# Altium project pdb-24.PrjPcb (part 2 of 2)

## Sheet can-stm32g4.SchDoc
size Legal; SheetNumber: 9; SheetTotal: 9
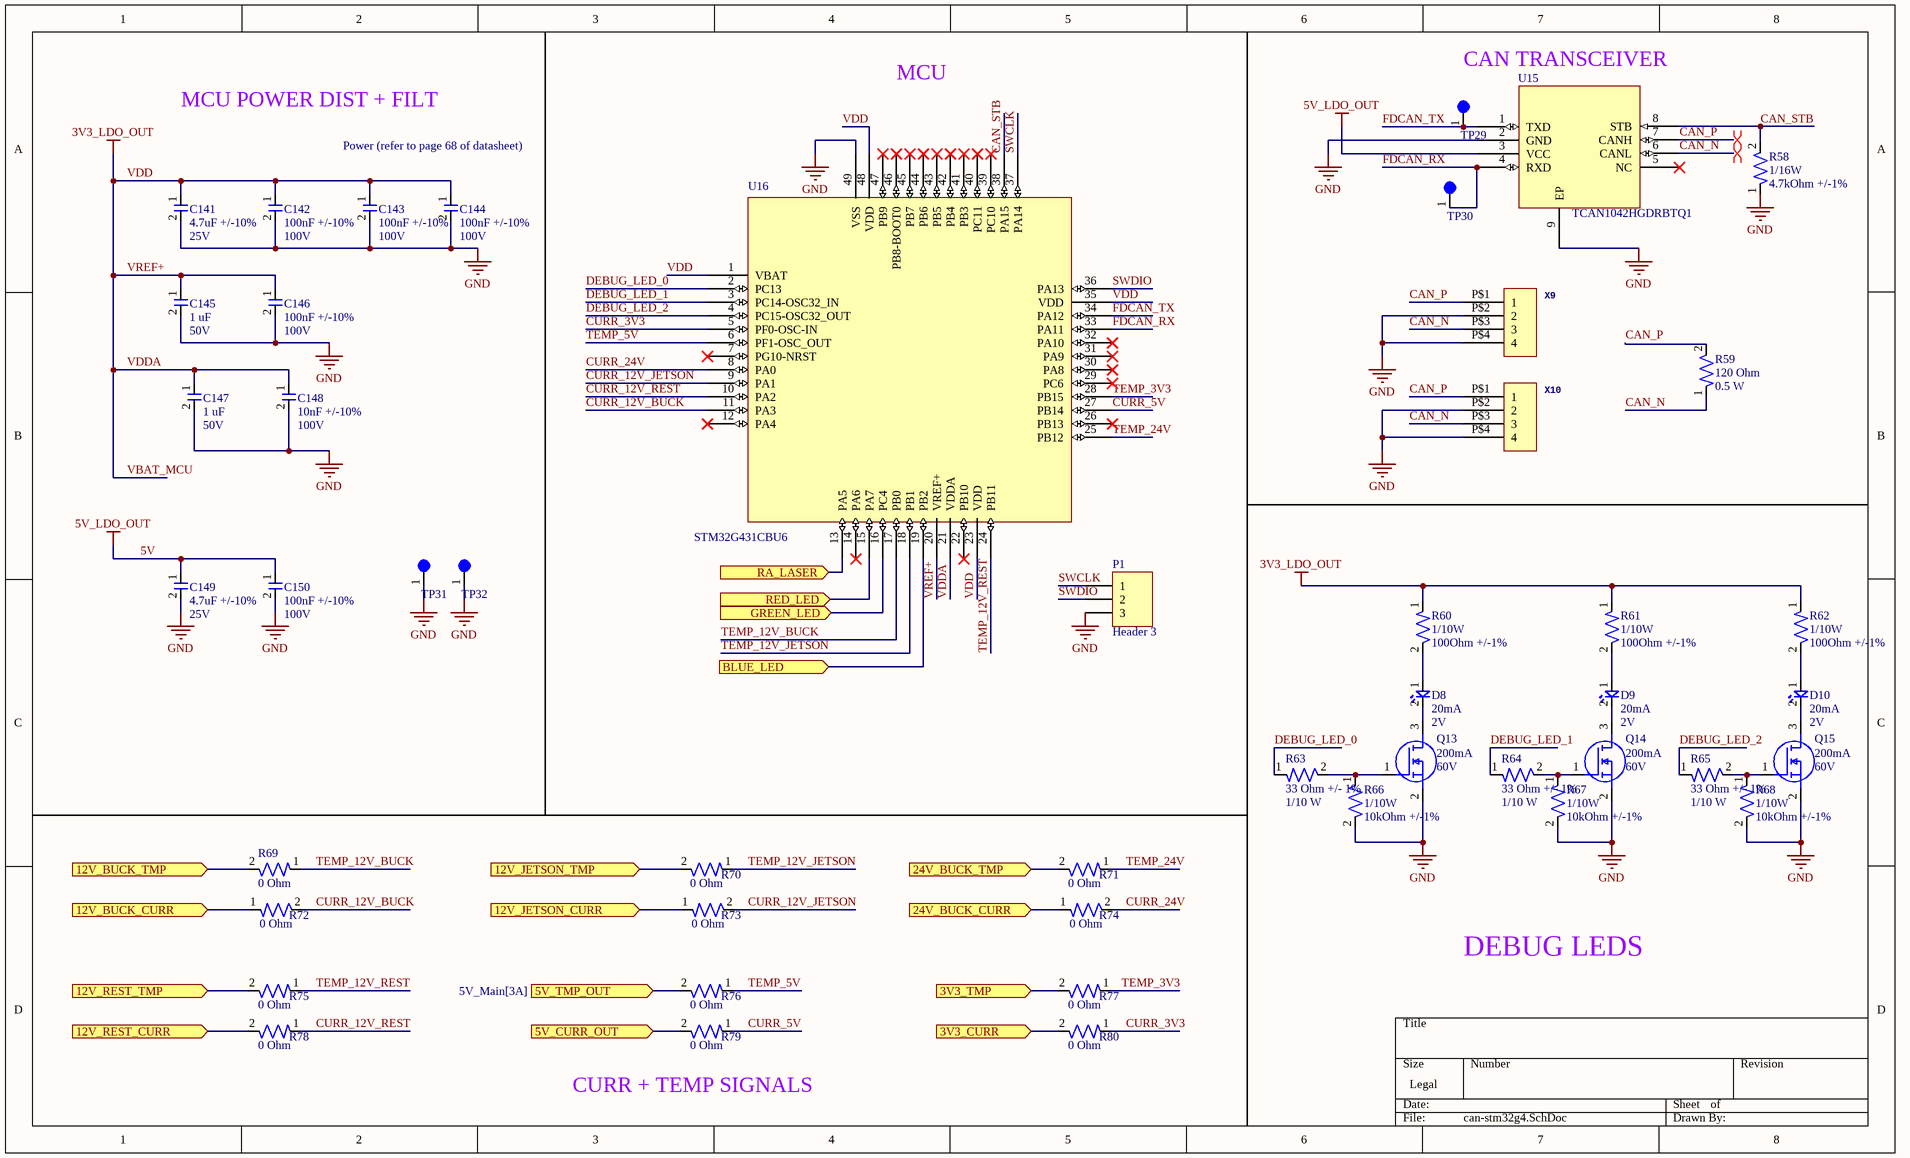
[diagram p7: can-stm32g4.SchDoc]

### Parts
C141  Capacitance: 4.7uF +/-10%  Voltage Rating: 25V  [CAP-0603]  (hidden comment: TMK107BBJ475KA-T)
C142  Capacitance: 100nF +/-10%  Voltage Rating: 100V  [CAP-0603]  (hidden comment: CC0603KRX7R0BB104)
C143  Capacitance: 100nF +/-10%  Voltage Rating: 100V  [CAP-0603]  (hidden comment: CC0603KRX7R0BB104)
C144  Capacitance: 100nF +/-10%  Voltage Rating: 100V  [CAP-0603]  (hidden comment: CC0603KRX7R0BB104)
C145  Capacitance: 1 uF  Voltage: 50V  [CAP-0603]  (hidden comment: UMK107AB7105KA-T)
C146  Capacitance: 100nF +/-10%  Voltage Rating: 100V  [CAP-0603]  (hidden comment: CC0603KRX7R0BB104)
C147  Capacitance: 1 uF  Voltage: 50V  [CAP-0603]  (hidden comment: UMK107AB7105KA-T)
C148  Capacitance: 10nF +/-10%  Voltage Rating: 100V  [CAP-0402]  (hidden comment: CC0402KRX7R0BB103)
C149  Capacitance: 4.7uF +/-10%  Voltage Rating: 25V  [CAP-0603]  (hidden comment: TMK107BBJ475KA-T)
C150  Capacitance: 100nF +/-10%  Voltage Rating: 100V  [CAP-0603]  (hidden comment: CC0603KRX7R0BB104)
D8  Current Rating: 20mA  Vf: 2V  [LED-0603]  (hidden comment: 150060AS75000)
D9  Current Rating: 20mA  Vf: 2V  [LED-0603]  (hidden comment: 150060AS75000)
D10  Current Rating: 20mA  Vf: 2V  [LED-0603]  (hidden comment: 150060AS75000)
P1  Header 3  [HDR1X3]
Q13  Id-Continuous: 200mA  VDS-Max: 60V  [NMOS-SOT23-3]  (hidden comment: T2N7002AK,LM)
Q14  Id-Continuous: 200mA  VDS-Max: 60V  [NMOS-SOT23-3]  (hidden comment: T2N7002AK,LM)
Q15  Id-Continuous: 200mA  VDS-Max: 60V  [NMOS-SOT23-3]  (hidden comment: T2N7002AK,LM)
R58  Power Rating: 1/16W  Resistance: 4.7kOhm +/-1%  [RES-0402]  (hidden comment: RC0402FR-074K7P)
R59  Resistance: 120 Ohm  Power: 0.5 W  [RES-1206]  (hidden comment: CRGH1206F120R)
R60  Power Rating: 1/10W  Resistance: 100Ohm +/-1%  [RES-0603]  (hidden comment: AC0603FR-10100RL)
R61  Power Rating: 1/10W  Resistance: 100Ohm +/-1%  [RES-0603]  (hidden comment: AC0603FR-10100RL)
R62  Power Rating: 1/10W  Resistance: 100Ohm +/-1%  [RES-0603]  (hidden comment: AC0603FR-10100RL)
R63  Resistance: 33 Ohm +/- 1%  Power: 1/10 W  [RES-0402]  (hidden comment: ERJ2RKF33R0X)
R64  Resistance: 33 Ohm +/- 1%  Power: 1/10 W  [RES-0402]  (hidden comment: ERJ2RKF33R0X)
R65  Resistance: 33 Ohm +/- 1%  Power: 1/10 W  [RES-0402]  (hidden comment: ERJ2RKF33R0X)
R66  Power Rating: 1/10W  Resistance: 10kOhm +/-1%  [RES-0603]  (hidden comment: RC0603FR-0710KP)
R67  Power Rating: 1/10W  Resistance: 10kOhm +/-1%  [RES-0603]  (hidden comment: RC0603FR-0710KP)
R68  Power Rating: 1/10W  Resistance: 10kOhm +/-1%  [RES-0603]  (hidden comment: RC0603FR-0710KP)
R69  Resistance: 0 Ohm  [RES-0603]  (hidden comment: RMCF0603ZT0R00)
R70  Resistance: 0 Ohm  [RES-0603]  (hidden comment: RMCF0603ZT0R00)
R71  Resistance: 0 Ohm  [RES-0603]  (hidden comment: RMCF0603ZT0R00)
R72  Resistance: 0 Ohm  [RES-0603]  (hidden comment: RMCF0603ZT0R00)
R73  Resistance: 0 Ohm  [RES-0603]  (hidden comment: RMCF0603ZT0R00)
R74  Resistance: 0 Ohm  [RES-0603]  (hidden comment: RMCF0603ZT0R00)
R75  Resistance: 0 Ohm  [RES-0603]  (hidden comment: RMCF0603ZT0R00)
R76  Resistance: 0 Ohm  [RES-0603]  (hidden comment: RMCF0603ZT0R00)
R77  Resistance: 0 Ohm  [RES-0603]  (hidden comment: RMCF0603ZT0R00)
R78  Resistance: 0 Ohm  [RES-0603]  (hidden comment: RMCF0603ZT0R00)
R79  Resistance: 0 Ohm  [RES-0603]  (hidden comment: RMCF0603ZT0R00)
R80  Resistance: 0 Ohm  [RES-0603]  (hidden comment: RMCF0603ZT0R00)
TP29  5003  [TEST-POINT-0001]  (value not drawn)
TP30  5003  [TEST-POINT-0001]  (value not drawn)
TP31  5003  [TEST-POINT-0001]  (value not drawn)
TP32  5003  [TEST-POINT-0001]  (value not drawn)
U15  TCAN1042HGDRBTQ1  [IC-8-VSON]
U16  STM32G431CBU6  [MCU-UFQFPN48]
X9  Molex 43045-0412  [43045-0412]  (value not drawn)
X10  Molex 43045-0412  [43045-0412]  (value not drawn)

### Ports
3V3_CURR (in), 3V3_TMP (in), 5V_CURR_OUT (in, see 5V_Main[2D]), 5V_TMP_OUT (in, see 5V_Main[3A]), 12V_BUCK_CURR (in, see 12V_For_Bucks[4D]), 12V_BUCK_TMP (in, see 12V_For_Bucks[3A]), 12V_JETSON_CURR (in, see 12V_Jetson[4D]), 12V_JETSON_TMP (in, see 12V_Jetson[3A]), 12V_REST_CURR (in, see 12V_Rest[4D]), 12V_REST_TMP (in, see 12V_Rest[3A]), 24V_BUCK_CURR (in, see 24V_Main[2D]), 24V_BUCK_TMP (in, see 24V_Main[4B]), BLUE_LED (in, see Connectors[1C]), GREEN_LED (in, see Connectors[1C]), RA_LASER (in, see Connectors[2C]), RED_LED (in, see Connectors[1D])

### Nets
5V: C149.1 C150.1 U15.3(VCC)  [also labelled 5V_LDO_OUT]
GND: C141.2 C142.2 C143.2 C144.2 C145.2 C146.2 C147.2 C148.2 C149.2 C150.2 P1.3 Q13.2(S) Q14.2(S) Q15.2(S) R58.1 R66.2 R67.2 R68.2 TP31.1 TP32.1 U15.2(GND) U15.9(EP) U16.49(VSS) X9.P$2(2) X9.P$4(4) X10.P$2(2) X10.P$4(4)
VBAT_MCU: C141.1 C142.1 C143.1 C144.1 C145.1 C146.1 C147.1 C148.1 R60.1 R61.1 R62.1 U16.1(VBAT) U16.20(VREF+) U16.21(VDDA) U16.23(VDD) U16.35(VDD) U16.48(VDD)  [also labelled 3V3_LDO_OUT, VDD, VDDA, VREF+]
CAN_N: R59.1 U15.6(CANL) X9.P$3(3) X10.P$3(3)
CAN_P: R59.2 U15.7(CANH) X9.P$1(1) X10.P$1(1)
CAN_STB: R58.2 U15.8(STB) U16.38(PA15)
CURR_3V3: R80.1 U16.5(PF0-OSC-IN)
CURR_5V: R79.1 U16.27(PB14)
CURR_12V_BUCK: R72.2 U16.11(PA3)
CURR_12V_JETSON: R73.2 U16.9(PA1)
CURR_12V_REST: R78.1 U16.10(PA2)
CURR_24V: R74.2 U16.8(PA0)
DEBUG_LED_0: R63.1 U16.2(PC13)
DEBUG_LED_1: R64.1 U16.3(PC14-OSC32_IN)
DEBUG_LED_2: R65.1 U16.4(PC15-OSC32_OUT)
FDCAN_RX: TP30.1 U15.4(RXD) U16.33(PA11)
FDCAN_TX: TP29.1 U15.1(TXD) U16.34(PA12)
SWCLK: P1.1 U16.37(PA14)
SWDIO: P1.2 U16.36(PA13)
TEMP_3V3: R77.1 U16.28(PB15)
TEMP_5V: R76.1 U16.6(PF1-OSC_OUT)
TEMP_12V_BUCK: R69.1 U16.17(PB0)
TEMP_12V_JETSON: R70.1 U16.18(PB1)
TEMP_12V_REST: R75.1 U16.24(PB11)
TEMP_24V: R71.1 U16.25(PB12)
NetD8_1: D8.1 R60.2
NetD8_2: D8.2 Q13.3(D)
NetD9_1: D9.1 R61.2
NetD9_2: D9.2 Q14.3(D)
NetD10_1: D10.1 R62.2
NetD10_2: D10.2 Q15.3(D)
NetQ2_1: U16.19(PB2) ; port BLUE_LED
NetQ3_1: U16.16(PC4) ; port GREEN_LED
NetQ4_1: U16.13(PA5) ; port RA_LASER
NetQ5_1: U16.15(PA7) ; port RED_LED
NetQ13_1: Q13.1(G) R63.2 R66.1
NetQ14_1: Q14.1(G) R64.2 R67.1
NetQ15_1: Q15.1(G) R65.2 R68.1
NetR3_2: R71.2 ; port 24V_BUCK_TMP
NetR12_2: R69.2 ; port 12V_BUCK_TMP
NetR19_2: R75.2 ; port 12V_REST_TMP
NetR28_2: R76.2 ; port 5V_TMP_OUT
NetR70_2: R70.2 ; port 12V_JETSON_TMP
NetR72_1: R72.1 ; port 12V_BUCK_CURR
NetR73_1: R73.1 ; port 12V_JETSON_CURR
NetR74_1: R74.1 ; port 24V_BUCK_CURR
NetR77_2: R77.2 ; port 3V3_TMP
NetR78_2: R78.2 ; port 12V_REST_CURR
NetR79_2: R79.2 ; port 5V_CURR_OUT
NetR80_2: R80.2 ; port 3V3_CURR

Not connected (* = marked no-connect by the designer): U15 5(NC)*; U16 7(PG10-NRST)* 12(PA4)* 14(PA6)* 22(PB10)* 26(PB13)* 29(PC6)* 30(PA8)* 31(PA9)* 32(PA10)* 39(PC10)* 40(PC11)* 41(PB3)* 42(PB4)* 43(PB5)* 44(PB6)* 45(PB7)* 46(PB8-BOOT0)* 47(PB9)*

### Layout directives
differential pair: CAN_N, CAN_P

### Notes on the sheet
- MCU
- CAN TRANSCEIVER
- MCU POWER DIST + FILT
- Power (refer to page 68 of datasheet)
- DEBUG LEDS
- (near R79) CURR + TEMP SIGNALS

### Library data of the parts
C141 C149 = CAP-4.7U-0001: 4.7 µF ±10% 25V Ceramic Capacitor X5R 0603 (1608 Metric); Manufacturer: Taiyo Yuden; Assembled?: no; Manufacturer Part Number: TMK107BBJ475KA-T; Temperature Coefficient: X5R; Package Size: 0603
C142-C144 C146 C150 = CAP-100N-0001: CAP CER 0.1UF 100V X7R 0603; Manufacturer: YAGEO; Assembled?: no; Manufacturer Part Number: CC0603KRX7R0BB104; Temperature Coefficient: X7R; Package Size: 0603
C145 C147 = CAP-1U-0002: 1 µF ±10% 50V Ceramic Capacitor X7R 0603 (1608 Metric); Package Size: 0603
C148 = CAP-10N-0001: 10000 pF ±10% 100V Ceramic Capacitor X7R 0402 (1005 Metric); Manufacturer: YAGEO; Assembled?: no; Manufacturer Part Number: CC0402KRX7R0BB103; Temperature Coefficient: X7R; Package Size: 0402
D8-D10 = LED_Amber_0001: CAP CER 0.1UF 100V X7R 0603; Manufacturer: Wurth Electronik; Assembled?: no; Color: Amber; Manufacturer Part Number: 150060AS75000; Package Size: 0603
P1 = Header 3: Header, 3-Pin; LatestRevisionDate: 17-Jul-2002; LatestRevisionNote: Re-released for DXP Platform.; Publisher: Altium Limited
Q13-Q15 = NMOS-200MA-0001: MOSFET N-CH 60V 200MA SOT23; Manufacturer: Toshiba; FET type: N-Channel; Rds On-Max: 3.9Ohm; Vgs-Max: 20V; Assembled?: no; Manufacturer Part Number: T2N7002AK,LM; Package: SOT-23-3
R58 = RES-4.7K-0001: RES SMD 4.7K OHM 1% 1/16W 0402; Manufacturer: YAGEO; Assembled?: no; Manufacturer Part Number: RC0402FR-074K7P; Package Size: 0402
R59 = RES-120-0002: 120 Ohms ±1% 0.5W, 1/2W Chip Resistor 1206 (3216 Metric) Thick Film; Tolerance: 1%; Package Size: 1206
R60-R62 = RES-100-0002: 100 Ohms ±1% 0.1W, 1/10W Chip Resistor 0603 (1608 Metric) Automotive AEC-Q200 Thick Film; Manufacturer: YAGEO; Assembled?: no; Manufacturer Part Number: AC0603FR-10100RL; Package Size: 0603
R63-R65 = RES-33-0003-JLC: 100mW Thick Film Resistors ±100ppm/℃ ±1% -55℃~+155℃ 33Ω 0402  Chip Resistor - Surface Mount ROHS; assembled?: yes; JLC part number: C278594
R66-R68 = RES-10K-0002: RES SMD 10K OHM 1% 1/10W 0603; Manufacturer: YAGEO; Assembled?: no; Manufacturer Part Number: RC0603FR-0710KP; Package Size: 0603
R69-R80 = RES-0-0001: 0 Ohms Jumper 0.1W, 1/10W Chip Resistor 0603 (1608 Metric) Automotive AEC-Q200 Thick Film; Package Size: 0603
TP29-TP32 = TEST-POINT-0001: Oranange PC Test Point, Miniature Phoisphor Bronze Silver Plating Through Hole Mounting Type
U15 = IC-CAN-TRANSCEIVER-0002: 1/1 Transceiver CANbus 8-VSON (3x3); Manufacturer: Texas Instrument; CAN Capability: FD-CAN; Manufacturer Part Number: TCAN1042HGDRBTQ1
U16 = IC-STM32G431CBU6: 128KB 1.71V~3.6V ARM-MSeries 32KB 170MHz FLASH 42 UFQFPN-48(7x7) Microcontroller Units (MCUs/MPUs/SOCs) ROHS; Assembled?: no; Manufacturer Part Number: STM32G431CBU6; Package: UFQFPN-48
X9 X10 = Micro-Fit Molex 4 Pin 2 Row Vertical: GateName_1: G$1; SymbolName_1: HEADER_POS4; DeviceSetName: HEADER_POS4_?; DeviceName: 43045-0412; LibraryName: con-molex-micro-fit-3_0_2; Package: 43045-0412

## Nets that join several sheets
3V3_BUCK_MAIN: Connectors (7 pins), 24V_Main (C23.1 U2.8), 18V_Jetson (C24.1 U4.8), 12V_For_Bucks (C37.1 U6.8), 12V_Rest (C47.1 U8.8), 5V_Main (C60.1 U10.8)
5V: 5V-and-3V3-ldo (7 pins), can-stm32g4 (C149.1 C150.1 U15.3)
5V_BUCK_MAIN: Connectors (9 pins), 5V_Main (F2.2 TP21.1)
12V_BUCK_MAIN: 12V_For_Bucks (12 pins), 5V_Main (8 pins), 5V-and-3V3-ldo (C129.1 C135.1 U13.1 U14.1)
12V_REST_MAIN: Connectors (6 pins), 12V_Rest (F3.2 TP20.1)
18V_JETSON_MAIN: Connectors (X2.P$1 X2.P$2 X2.P$3 X2.P$4), 18V_Jetson (F5.2 TP9.1)
24V_BUCK_MAIN: Connectors (X1.P$1 X1.P$2 X1.P$3 X1.P$4), 24V_Main (F6.2 TP3.1)
GND: Connectors (37 pins), 24V_Main (41 pins), 18V_Jetson (41 pins), 12V_For_Bucks (41 pins), 12V_Rest (41 pins), 5V_Main (21 pins), 5V-and-3V3-ldo (16 pins), can-stm32g4 (27 pins)
VBAT: Connectors (D1.1 J1.2 R1.1), 24V_Main (12 pins), 18V_Jetson (12 pins), 12V_For_Bucks (11 pins), 12V_Rest (11 pins)
VBAT_MCU: 24V_Main (C11.1 R3.1), 18V_Jetson (C32.1 R7.1), 12V_For_Bucks (C55.1 R12.1), 12V_Rest (C78.1 R19.1), 5V_Main (C100.1 R28.1), 5V-and-3V3-ldo (7 pins), can-stm32g4 (17 pins)
NetQ2_1: Connectors (Q2.1 R4.2), can-stm32g4 (U16.19)
NetQ3_1: Connectors (Q3.1 R5.2), can-stm32g4 (U16.16)
NetQ4_1: Connectors (Q4.1 R6.2), can-stm32g4 (U16.13)
NetQ5_1: Connectors (Q5.1 R8.2), can-stm32g4 (U16.15)
NetR3_2: 24V_Main (R3.2 R15.2), can-stm32g4 (R71.2)
NetR12_2: 12V_For_Bucks (R12.2 R29.2), can-stm32g4 (R69.2)
NetR19_2: 12V_Rest (R19.2 R38.2), can-stm32g4 (R75.2)
NetR28_2: 5V_Main (R28.2 R48.2), can-stm32g4 (R76.2)
NetR72_1: 12V_For_Bucks (U6.7), can-stm32g4 (R72.1)
NetR74_1: 24V_Main (U2.7), can-stm32g4 (R74.1)
NetR78_2: 12V_Rest (U8.7), can-stm32g4 (R78.2)
NetR79_2: 5V_Main (U10.7), can-stm32g4 (R79.2)